# EAGLE design QuadroOLED (EAGLE 6.6.0)
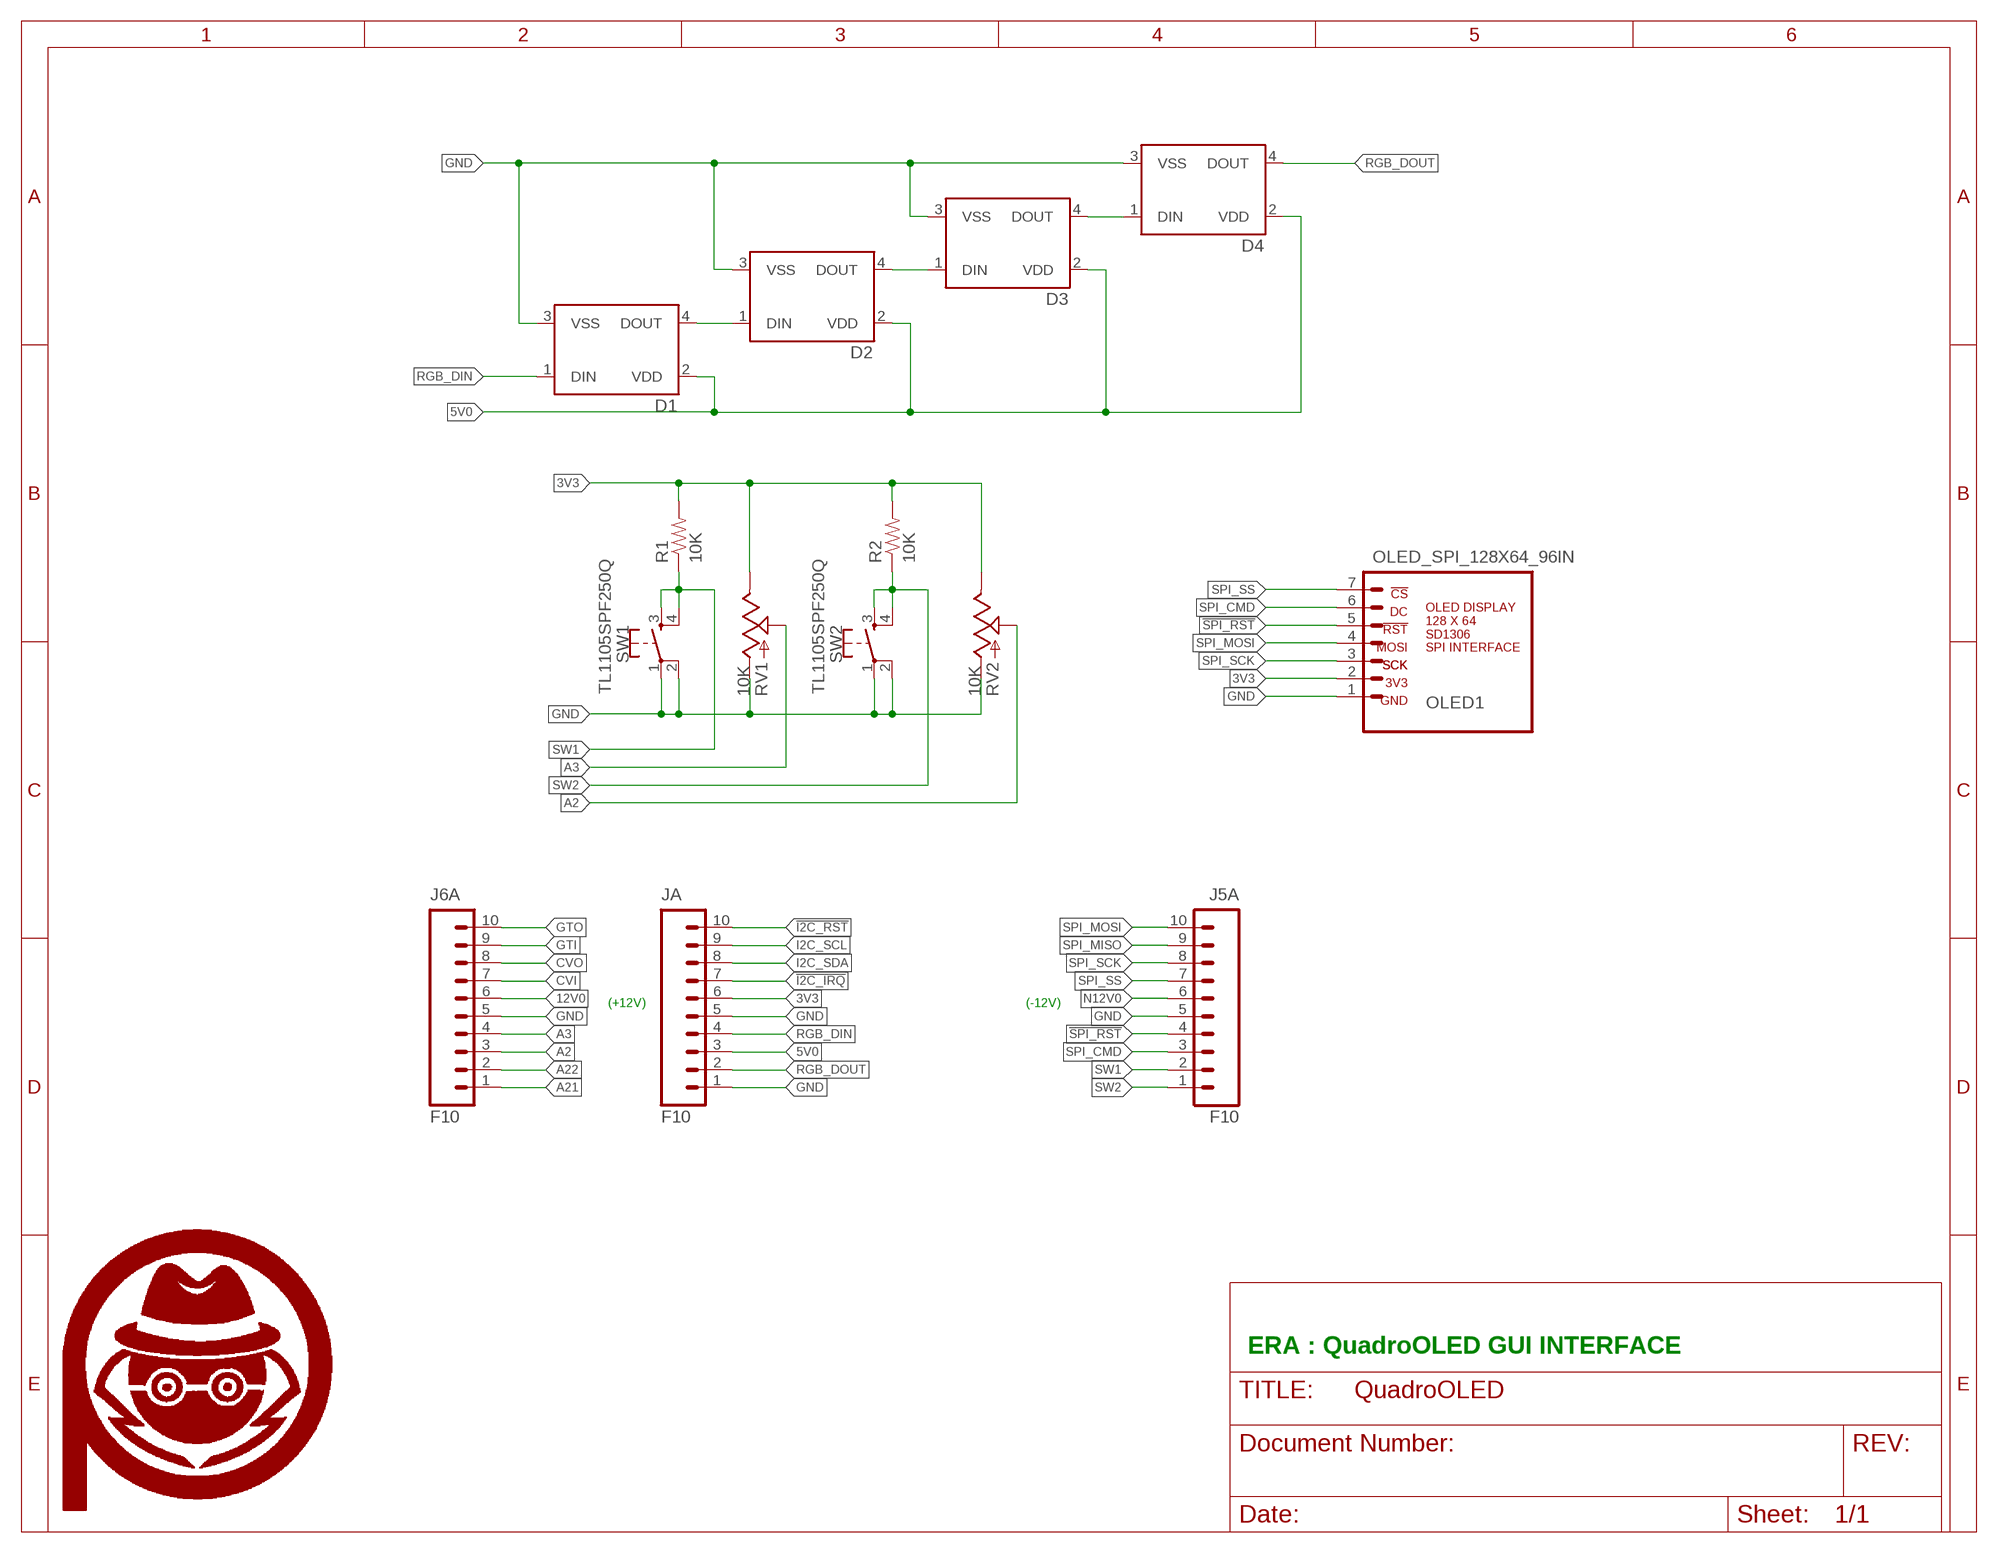
[diagram p0: schematic, sheet 1]

## Parts
D1  WS2812B_PTH  [LED-RGB-THRU]
D2  WS2812B_PTH  [LED-RGB-THRU]
D3  WS2812B_PTH  [LED-RGB-THRU]
D4  WS2812B_PTH  [LED-RGB-THRU]
J5A  F10  M10SILK_FEMALE_PTH  [1X10_OCTO]
J6A  F10  M10SILK_FEMALE_PTH  [1X10_OCTO]
JA  F10  M10SILK_FEMALE_PTH  [1X10_OCTO]
OLED1  OLED_SPI_128X64_96IN  [OLED_128X64_96]
R1  10K  RESISTOR0603  [0603-RES]
R2  10K  RESISTOR0603  [0603-RES]
RV1  10K  POT  [ALPS_POT]
RV2  10K  POT  [ALPS_POT]
SW1  TL1105SPF250Q  [TL1105SPF250Q]
SW2  TL1105SPF250Q  [TL1105SPF250Q]
U$1  PA_LOGO_SYMLARGE  [PA_LOGO_AGENT_LRG_SYM]
U$2  PA_LOGO_SYMLARGE  [PA_LOGO_AGENT_LRG_SYM]

## Nets
3V3: JA.6 OLED1.2 R1.2 R2.2 RV1.P$1 RV2.P$1
5V0: D1.2(VDD) D2.2(VDD) D3.2(VDD) D4.2(VDD) JA.3
12V0: J6A.6
!I2C_IRQ: JA.7
!I2C_RST: JA.10
!SPI_RST: J5A.4 OLED1.5
A2: J6A.3 RV2.P$2
A3: J6A.4 RV1.P$2
A21: J6A.1
A22: J6A.2
CVI: J6A.7
CVO: J6A.8
GND: D1.3(VSS) D2.3(VSS) D3.3(VSS) D4.3(VSS) J5A.5 J6A.5 JA.1 JA.5 OLED1.1 RV1.P$3 RV2.P$3 SW1.1 SW1.2 SW2.1 SW2.2
GTI: J6A.9
GTO: J6A.10
I2C_SCL: JA.9
I2C_SDA: JA.8
N12V0: J5A.6
N$2: D1.4(DOUT) D2.1(DIN)
N$3: D2.4(DOUT) D3.1(DIN)
N$4: D3.4(DOUT) D4.1(DIN)
RGB_DIN: D1.1(DIN) JA.4
RGB_DOUT: D4.4(DOUT) JA.2
SPI_CMD: J5A.3 OLED1.6
SPI_MISO: J5A.9
SPI_MOSI: J5A.10 OLED1.4
SPI_SCK: J5A.8 OLED1.3
SPI_SS: J5A.7 OLED1.7
SW1: J5A.2 R1.1 SW1.3 SW1.4
SW2: J5A.1 R2.1 SW2.3 SW2.4

## Notes on the sheet
- (+12V) | (-12V)
- ERA : QuadroOLED GUI INTERFACE

## Library data of the parts
D1-D4 = halcyonmod_Optoelectronics:WS2812B: WS2812B - Intelligent control LED integrated light source Technical Specifications: Power Supply Voltage (VDD): 3.5 to 5.3 V Input Voltage (VI): -0.5 to VDD+0.5 V Operating Junction Temperature (Topt): -25°C to +80°C Storage Temperature Range (Tstg): -55°C to +150°C
J5A J6A JA = oXo_Connectors:M10: Header 10 Standard 10-pin 0.1" header. Use with straight break away headers (SKU : PRT-00116), right angle break away headers (PRT-00553), swiss pins (PRT-00743), machine pins (PRT-00117), and female headers (PRT-00115).; PROD_ID: CONN-11563
OLED1 = PatternAgents-ProtoPads:OLED_SPI_128X64_96IN
R1 R2 = PatternAgents-ProtoPads:RESISTOR: Resistor Basic schematic elements and footprints for 0603, 1206, and PTH resistors.
RV1 RV2 = halcyonmod_Potentiometers:POT; PROD_ID: RES-09177
SW1 SW2 = halcyonmod_Switches:TL1105SPF250Q: E-Switch TL1105SPF250Q Digikey EG1862-ND <https://www.digikey.com/product-detail/en/e-switch/TL1105SPF250Q/EG1862-ND/271559>
U$1 U$2 = PatternAgents-Logos:PA_LOGO_SYM: PatternAgents Logo Symbol Trademark : PatternAgents, LLC Github : https://github.com/PatternAgents/PCB_Libraries License : http://creativecommons.org/licenses/by-sa/3.0/ (Creative Commons 3.0) THIS SOFTWARE IS PROVIDED BY THE CONTRIBUTORS "AS IS" AND WITHOUT ANY EXPRESS OR IMPLIED WARRANTIES, INCLUDING, BUT NOT LIMITED TO, THE IMPLIED WARRANTIES OF MERCHANTABILITY AND FITNESS FOR A PARTICULAR PURPOSE ARE DISCLAIMED. IN NO EVENT SHALL THE COPYRIGHT OWNER OR CONTRIBUTORS BE LIABLE FOR ANY DIRECT, INDIRECT, INCIDENTAL, SPECIAL, EXEMPLARY, OR CONSEQUENTIAL DAMAGES (INCLUDING, BUT NOT LIMITED TO, PROCUREMENT OF SUBSTITUTE GOODS OR SERVICES; LOSS OF USE, DATA, OR PROFITS; OR BUSINESS INTERRUPTION) HOWEVER CAUSED AND ON ANY THEORY OF LIABILITY, WHETHER IN CONTRACT, STRICT LIABILITY, OR TORT (INCLUDING NEGLIGENCE OR OTHERWISE) ARISING IN ANY WAY OUT OF THE USE OF THIS SOFTWARE, EVEN IF ADVISED OF THE POSSIBILITY OF SUCH DAMAGE.

## Board
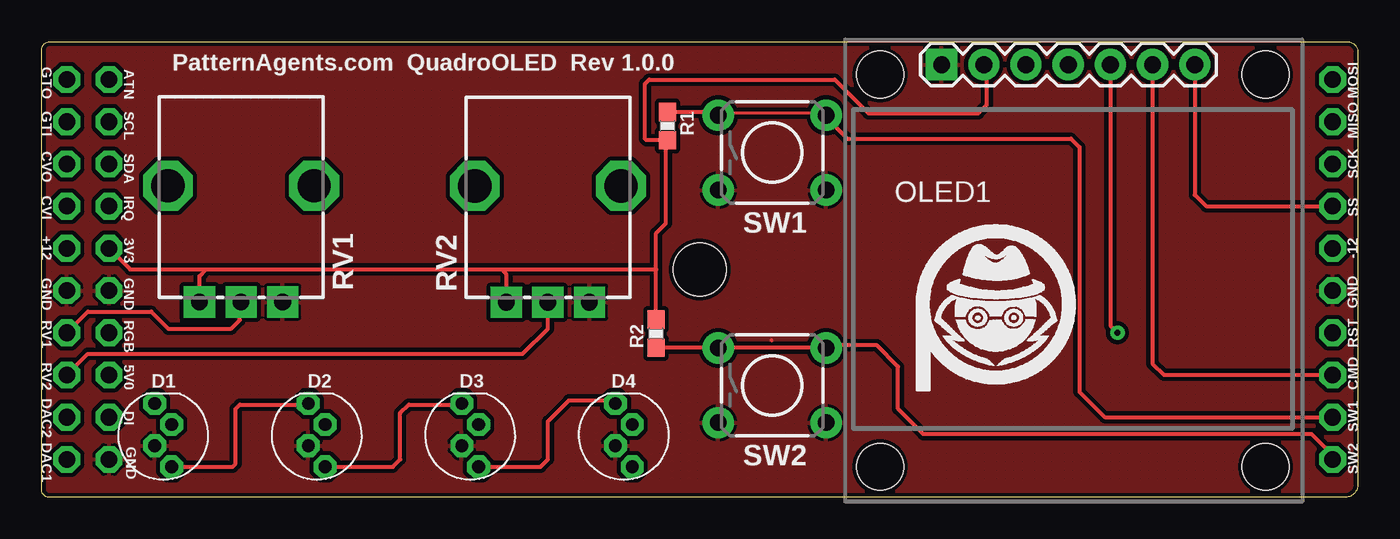
[diagram p1: board, top side]
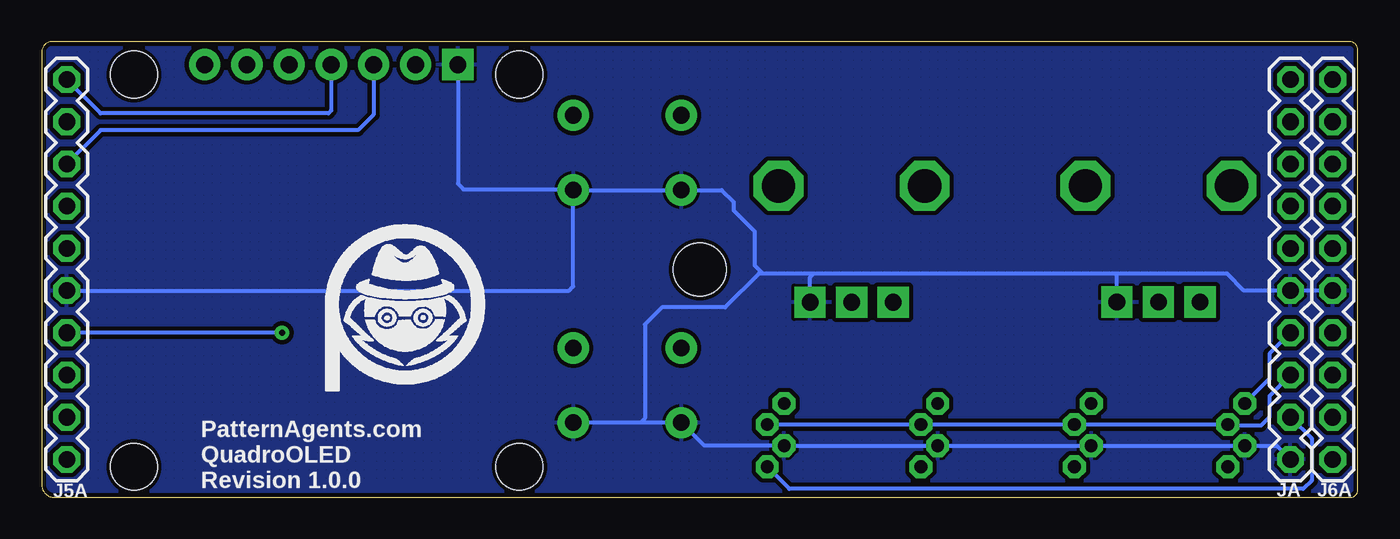
[diagram p2: board, bottom side, seen from below]

Size 79.25 x 27.43 mm. Coordinates in mm from the lower left corner, seen from the top.
Outline: 0.54,27.43 78.58,27.43 arc-90 79.25,26.76 79.25,0.79 arc-90 78.45,0 0.46,0 arc-90 0,0.46 0,26.89 arc-90 0.54,27.43
Copper layers (1*16): Top 0.035mm / dielectric 1.5mm / Bottom 0.035mm
Design rules "PatternAgents_7mil": minimum track width 7mil, minimum drill 14mil, track to track 7mil, track to pad 7mil, pad to pad 7mil, via to via 7mil, smd to smd 7mil, copper to edge 7mil, drill to drill 7mil, minimum pad ring 12mil, minimum via ring 10mil, stop-mask expansion 4mil, vias tented up to drill 25mil, thermal gap 7mil
Holes 3.2 mm at 39.62,13.72

### Footprints (pad centres in the part's own frame; a part is rotated, then mirrored left to right if it is on the bottom)
LED-RGB-THRU = drill 0.762 pad 0.889 octagon: 1 1.905,0.508; 2 0.635,-0.508; 3 -0.635,0.508; 4 -1.905,-0.508
1X10_OCTO = drill 1 octagon: 1 0,0; 2 2.54,0; 3 5.08,0; 4 7.62,0; 5 10.16,0; 6 12.7,0; 7 15.24,0; 8 17.78,0; 9 20.32,0; 10 22.86,0
OLED_128X64_96 = drill 1.016 pad 1.88 square: 1 5.8,26.3 | drill 1.016 pad 1.88: 2 8.34,26.3; 3 10.88,26.3; 4 13.42,26.3; 5 15.96,26.3; 6 18.5,26.3; 7 21.04,26.3 | hole 2.8: 2.1,25.7; 25.3,25.7; 2.1,2.1; 25.3,2.1
0603-RES = smd 1.1 x 1: 1 -0.85,0; 2 0.85,0
ALPS_POT = drill 1 pad 1.88 square: P$1 7,-2.5; P$2 7,0; P$3 7,2.5 | drill 2 octagon: P$4 0,-4.4; P$5 0,4.4
TL1105SPF250Q = drill 1 pad 1.88: 1 -3.25,-2.25; 2 3.25,-2.25; 3 -3.25,2.25; 4 3.25,2.25

### Placement (x,y rotation side)
D1  7.32,3.75 90 top
D2  16.56,3.75 90 top
D3  25.8,3.75 90 top
D4  35.05,3.75 90 top
J5A  77.72,2.29 90 bottom
J6A  1.52,2.29 90 bottom
JA  4.06,2.29 90 bottom
OLED1  48.38,-0.25 0 top
R1  37.68,22.35 270 top
R2  36.99,9.85 90 top
RV1  12.01,18.75 270 top
RV2  30.48,18.75 270 top
SW1  43.98,20.75 0 top
SW2  43.98,6.75 0 top
U$1  57.53,10.79 0 top
U$2  57.28,10.79 0 bottom

### Tracks (layer width: path | path; a pad name or v marks a point on that pad's centre or on a via)
3V3
  Top 0.254: 9.91,13.72 5.33,13.72 JA.6 | 9.91,13.72 27.69,13.72 | 27.69,13.72 36.99,13.72 | RV1.P$1 9.51,13.32 9.91,13.72 | RV2.P$1 27.98,13.42 27.69,13.72 | R2.2 36.99,13.72 | 36.99,13.72 36.99,15.91 37.59,16.51 37.59,21.4 R1.2 36.42,21.5 36.32,21.59 36.32,24.89 36.58,25.15 47.75,25.15 49.78,23.11 56.39,23.11 56.9,23.62 56.9,25.87 OLED1.2
5V0
  Bottom 0.254: D4.2 D3.2 D2.2 D1.2 7.77,4.32 5.84,4.32 5.33,4.83 5.33,6.1 JA.3
!SPI_RST  (via drill 0.36)
  Top 0.254: OLED1.5 64.34,10.33 v64.77,9.91
  Bottom 0.254: v64.77,9.91 J5A.4
A2
  Top 0.254: J6A.3 2.79,8.64 28.96,8.64 30.48,10.16 RV2.P$2
A3
  Top 0.254: J6A.4 2.79,11.18 6.6,11.18 7.62,10.16 11.43,10.16 11.94,10.67 11.94,11.68 RV1.P$2
GND
  Top 0.178: 43.94,9.4 43.94,9.5
  Bottom 0.254: 14.48,13.46 7.87,13.46 6.86,12.45 JA.5 J6A.5 | 14.48,13.46 32.77,13.46 | 32.77,13.46 35.81,13.46 | 35.81,13.46 36.07,13.46 38.1,11.43 41.91,11.43 42.93,10.41 42.93,4.75 43.18,4.5 | 43.18,4.5 SW2.1 39.35,3.11 D4.3 D3.3 D2.3 D1.3 4.89,3.11 JA.1 | 43.18,4.5 SW2.2 | RV1.P$3 14.51,13.43 14.48,13.46 | RV2.P$3 32.98,13.24 32.77,13.46 | OLED1.1 54.18,18.88 53.85,18.54 47.28,18.54 SW1.2 | SW1.2 SW1.1 38.31,18.5 37.59,17.78 37.59,17.27 36.32,16 36.32,13.97 35.81,13.46 | SW1.2 47.24,12.7 47.5,12.45 J5A.5
  pour Bottom (isolate 0.254, hatched): 0,0 0,27.43 79.25,27.43 79.25,0
  pour Top (isolate 0.254, hatched): 0,0 0,27.43 79.25,27.43 79.25,0
N$2
  Top 0.254: D1.4 11.49,1.84 11.68,2.03 11.68,5.33 11.94,5.59 15.99,5.59 D2.1
N$3
  Top 0.254: D2.4 21.15,1.84 21.59,2.29 21.59,5.08 22.1,5.59 25.23,5.59 D3.1
N$4
  Top 0.254: D3.4 30.03,1.84 30.48,2.29 30.48,4.57 31.75,5.84 34.36,5.84 D4.1
RGB_DIN
  Bottom 0.254: JA.4 5.33,8.64 5.33,7.13 D1.1
RGB_DOUT
  Bottom 0.254: D4.4 34.23,0.51 3.3,0.51 2.79,1.02 2.79,3.56 JA.2
SPI_CMD
  Top 0.254: OLED1.6 66.88,8.05 67.56,7.37 J5A.3
SPI_MOSI
  Bottom 0.254: OLED1.4 61.8,23.29 61.98,23.11 75.69,23.11 J5A.10
SPI_SCK
  Bottom 0.254: OLED1.3 59.26,23.03 60.2,22.1 75.69,22.1 J5A.8
SPI_SS
  Top 0.254: OLED1.7 69.42,18.21 70.1,17.53 J5A.7
SW1
  Top 0.178: SW1.3 40.89,23.11 46.99,23.11 SW1.4
  Top 0.254: R1.1 40.53,23.2 SW1.3 | SW1.4 47.23,22.87 48.51,21.59 61.98,21.59 62.48,21.08 62.48,6.35 64.01,4.83 J5A.2
SW2
  Top 0.254: R2.1 SW2.3 SW2.4 47.38,9.14 50.29,9.14 51.56,7.87 51.56,5.33 53.09,3.81 76.45,3.81 77.72,2.54 J5A.1

### Text on the board
tPlace: GTO | ATN | PatternAgents.com QuadroOLED Rev 1.0.0 | MOSI | GTI | SCL | MISO | CVO | SDA | SCK | CVI | IRQ | SS | +12 | 3V3 | -12 | GND | GND | GND | RV1 | RGB | RST | RV2 | 5V0 | D1 | D2 | D3 | D4 | CMD | DAC2 | DI | DAC1 | SW1 | GND | SW2
bPlace: PatternAgents.com / QuadroOLED / Revision 1.0.0